# EAGLE design RECIEVER CIRCUIT (EAGLE 7.7.0)
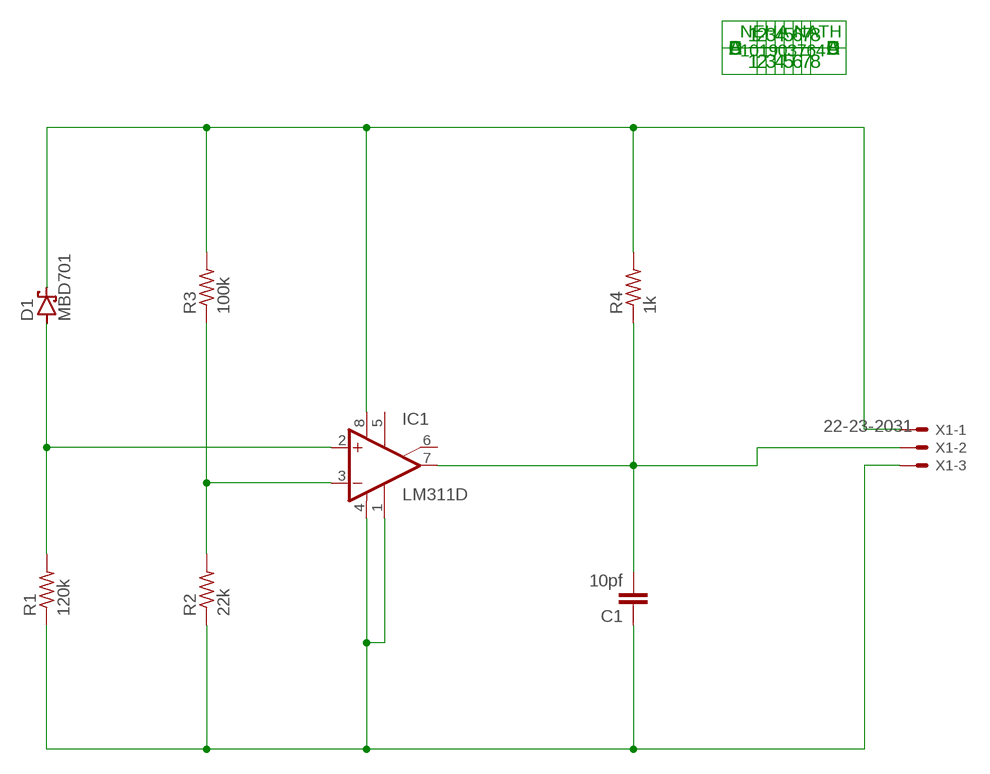
[diagram p0: schematic, sheet 1]

## Parts
C1  10pf  C2.5/4  [C2.5-4]
D1  MBD701  [TO92H]
IC1  LM311D  [SO08]
R1  120k  R-US_0207/15  [0207/15]
R2  22k  R-US_0207/15  [0207/15]
R3  100k  R-US_0207/15  [0207/15]
R4  1k  R-US_0207/15  [0207/15]
X1  22-23-2031  [22-23-2031]

## Nets
N$1: D1.2(C) IC1.8(V+) R3.2 R4.2 X1.1
N$2: C1.1 IC1.1(GND) IC1.4(V-) R1.1 R2.1 X1.3
N$3: D1.1(A) IC1.2(+IN) R1.2
N$4: IC1.3(-IN) R2.2 R3.1
N$5: C1.2 IC1.7(OUT) R4.1 X1.2
Unconnected: IC1.5(ON) IC1.6(ON/STR)

## Notes on the sheet
- NEHA NATH 
  101903764

## Library data of the parts
C1 = capacitor-wima:C: CAPACITOR naming: grid - package width
D1 = diode:MBD701: UHF DIODE
IC1 = linear:LM311: COMPARATOR
R1-R4 = rcl:R-US_: RESISTOR, American symbol; SPICEPREFIX: R
X1 = con-molex:22-23-2031: .100" (2.54mm) Center Header - 3 Pin; MF: MOLEX; MPN: 22-23-2031; OC_FARNELL: 1462950; OC_NEWARK: 30C0862

## Board
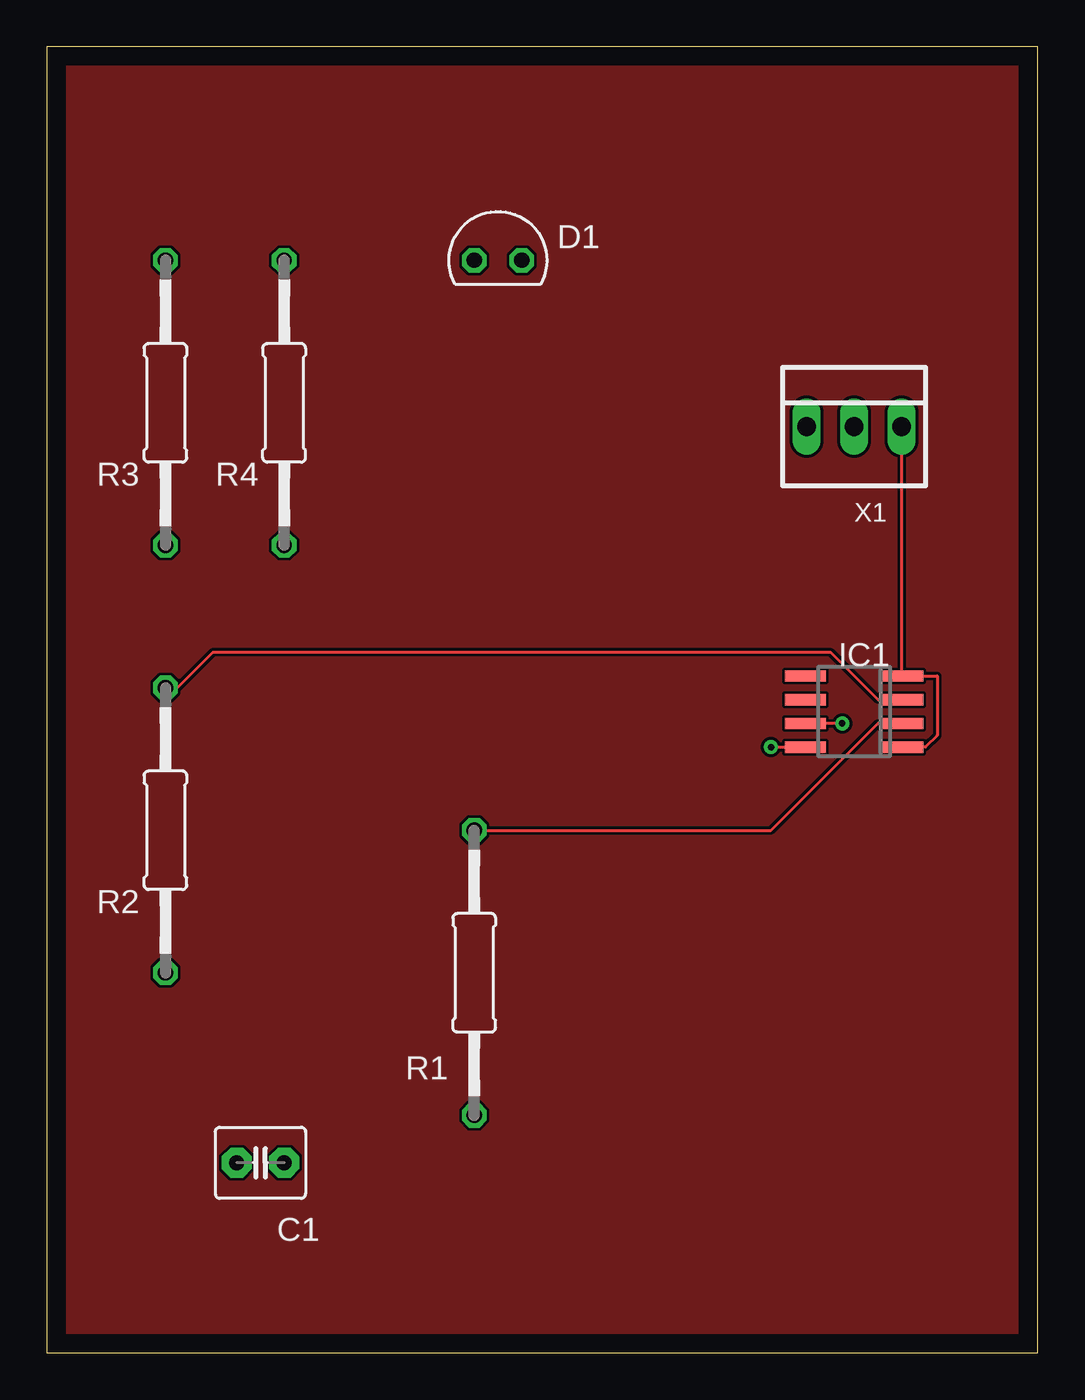
[diagram p1: board, top side]
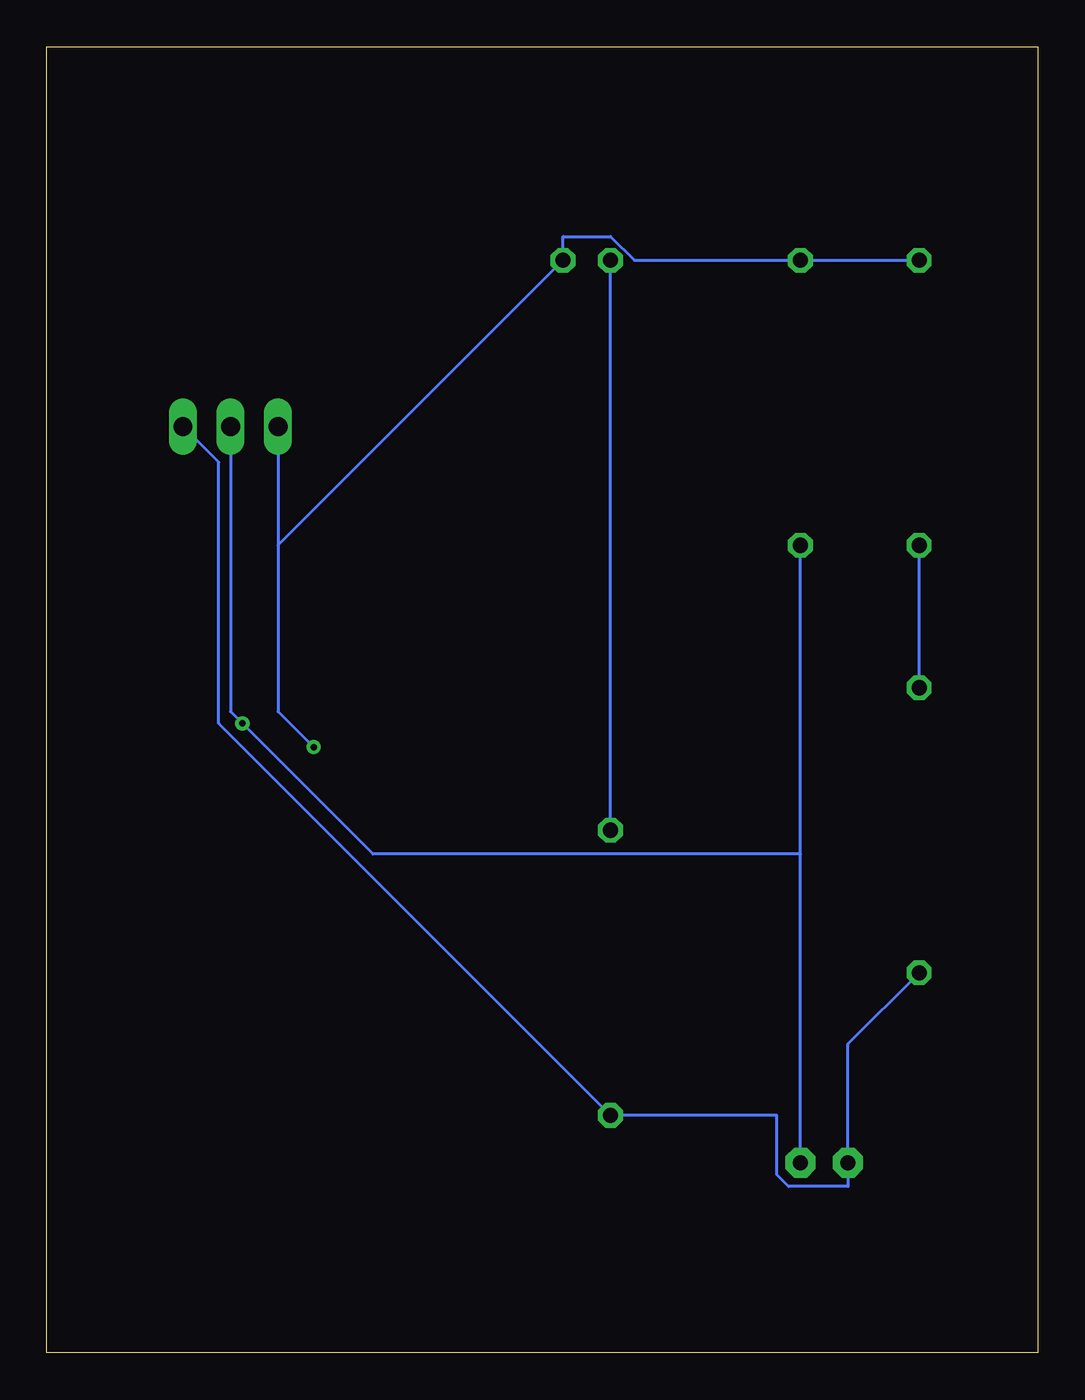
[diagram p2: board, bottom side, seen from below]

Size 53.01 x 69.84 mm. Coordinates in mm from the lower left corner, seen from the top.
Outline: 0,0 53.01,0 53.01,69.84 0,69.84 0,0
Copper layers (1*16): Top 0.035mm / dielectric 1.5mm / Bottom 0.035mm
Design rules "default": minimum track width 6mil, minimum drill 0.35mm, track to track 6mil, track to pad 6mil, pad to pad 6mil, via to via 6mil, smd to smd 6mil, copper to edge 40mil, drill to drill 6mil, minimum pad ring 10mil, minimum via ring 8mil, stop-mask expansion 4mil, vias tented up to drill 0mil, thermal gap 10mil

### Footprints (pad centres in the part's own frame; a part is rotated, then mirrored left to right if it is on the bottom)
C2.5-4 = drill 0.813 pad 1.6 octagon: 1 -1.27,0; 2 1.27,0
TO92H = drill 0.813 octagon: 1 -1.27,0; 2 1.27,0
SO08 = smd 0.6 x 2.2: 1 -1.905,-2.6; 2 -0.635,-2.6; 3 0.635,-2.6; 4 1.905,-2.6; 5 1.905,2.6; 6 0.635,2.6; 7 -0.635,2.6; 8 -1.905,2.6
0207/15 = drill 0.813 octagon: 1 -7.62,0; 2 7.62,0
22-23-2031 = drill 1 long: 1 -2.54,0; 2 0,0; 3 2.54,0

### Placement (x,y rotation side)
C1  11.43,10.16 0 top
D1  24.13,58.42 0 top
IC1  43.18,34.29 90 top
R1  22.86,20.32 90 top
R2  6.35,27.94 90 top
R3  6.35,50.8 90 top
R4  12.7,50.8 90 top
X1  43.18,49.53 0 top

### Tracks (layer width: path | path; a pad name or v marks a point on that pad's centre or on a via)
N$1  (via drill 0.35)
  Top 0.152: v38.73,32.39 IC1.8
  Bottom 0.152: R3.2 R4.2 21.59,58.42 22.86,59.69 25.4,59.69 D1.2 40.64,43.18 | v38.73,32.39 40.64,34.29 40.64,43.18 | X1.1 40.64,43.18
N$2
  Top 0.152: IC1.1 46.99,32.39 47.62,33.02 47.62,36.19 IC1.4 45.72,36.19 X1.3
  Bottom 0.152: R2.1 10.16,16.51 C1.1 10.16,8.89 13.34,8.89 13.97,9.52 13.97,12.7 R1.1 43.81,33.66 43.81,47.62 X1.3
N$3
  Top 0.152: IC1.2 44.45,33.66 38.73,27.94 R1.2
  Bottom 0.152: R1.2 D1.1
N$4
  Top 0.152: IC1.3 44.45,34.92 41.91,37.47 8.89,37.47 6.98,35.56 R2.2
  Bottom 0.152: R2.2 R3.1
N$5  (via drill 0.35)
  Top 0.152: v42.55,33.66 IC1.7
  Bottom 0.152: X1.2 43.18,34.29 v42.55,33.66 35.56,26.67 12.7,26.67 | C1.2 12.7,26.67 | 12.7,26.67 R4.1
N$6
  pour Top: 0,69.85 53.34,69.85 53.34,0 0,0

### Text on the board
Top: NEHA NATH / 101903764